# Altium schematic sheet sch.SchDoc
size A4; SheetNumber: 1; SheetTotal: 1
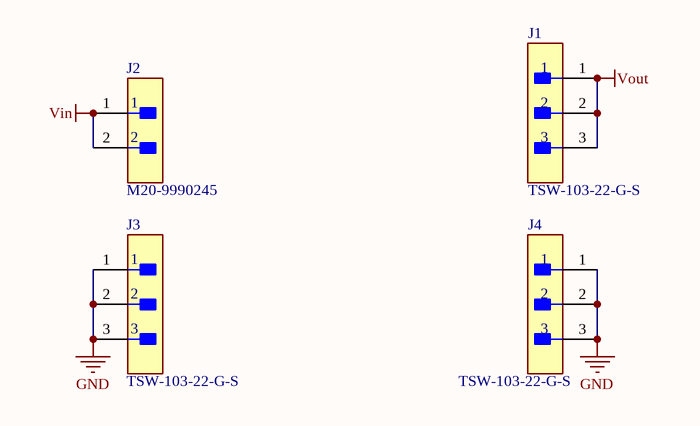
[diagram p0: sch.SchDoc]

## Parts
J1  TSW-103-22-G-S  [FP-TSW-103-22-G-S-MFG]
J2  M20-9990245  [FP-M20-9990245-MFG]
J3  TSW-103-22-G-S  [FP-TSW-103-22-G-S-MFG]
J4  TSW-103-22-G-S  [FP-TSW-103-22-G-S-MFG]

## Nets
GND: J3.1 J3.2 J3.3 J4.1 J4.2 J4.3
Vin: J2.1 J2.2
Vout: J1.1 J1.2 J1.3

## Library data of the parts
J1 J3 J4 = CMP-02766-000544-1: Conn Unshrouded Header HDR 3 POS 2.54mm Solder ST Thru-Hole Bulk; Max Current Rating: 7.6A; Gender: Male; Max Voltage Rating (AC): 550V; Number of Contacts: 3; Orientation: Straight; REACH SVHC: No SVHC; Pitch: 2.54mm; Termination: Solder; Length: 7.62mm; Contact Material: Bronze; Housing Color: Black; Housing Material: Polyester; Number of Rows: 1; Contact Plating: Gold; Min Operating Temperature: -55°C; Packaging: Bulk; Depth: 2.54mm; Max Operating Temperature: 125°C
J2 = CMP-15831-000105-1: CONN HEADER VERT 2POS 2.54MM; Working Voltage: 750V; Gender: Male; Number of Poles: 2; Current Rating: 3A; Mated Stacking Heights: 16.54mm; Contact Resistance: 25mR; Connector Type: Male Pin; Insulation Resistance: 10GR; Mating Cycles: 300; Voltage: 50V; Flammability Rating: UL94 V-0; Pitch: 2.54mm; Series: M20; Number of Contacts: 2; Height: 0.12inch; Min Operating Temperature: -40°C; Contact Finish - Mating: GOLD; Number of Positions: 2; Number of Rows: 1; Packaging: Bulk; Package Quantity: 1000; Voltage Rating (AC): 750V; Current: 3A; Mount: Through Hole; Case/Package: SIL; Orientation: Straight; Contact Shape: Square; Weight: 0.25lb; Radiation Hardening: No; Fastening Type: Pull; Length: 5.08mm; Depth: 2.54mm; Contact Mating Length: 0.24inch; Housing Material: Nylon; Reach SVHC Compliant: Yes; Insulation Material: Nylon; Color: Black; Width: 0.25inch; Insulation Color: Black; Contact Material: Brass; Contact Type: Male Pin; Termination: Solder; Max Operating Temperature: 105°C; Contact Plating: Gold; Housing Color: Black; Max Current Rating: 3A; Lead Pitch: 2.54mm